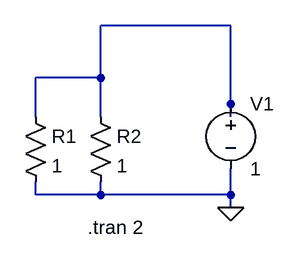
[diagram p0: schematic parallel.asc]
parallel.asc, the LTspice schematic file:
Version 4
SHEET 1 880 680
WIRE 176 128 16 128
WIRE 16 192 16 128
WIRE 16 192 -64 192
WIRE 176 224 176 128
WIRE -64 240 -64 192
WIRE 16 240 16 192
WIRE 176 240 176 224
WIRE -64 336 -64 320
WIRE 16 336 16 320
WIRE 16 336 -64 336
WIRE 176 336 176 304
WIRE 176 336 16 336
WIRE 176 352 176 336
FLAG 176 352 0
SYMBOL res 0 224 R0
SYMATTR InstName R2
SYMATTR Value 1
SYMBOL voltage 176 208 R0
WINDOW 123 0 0 Left 2
WINDOW 39 0 0 Left 2
SYMATTR InstName V1
SYMATTR Value 1
SYMBOL res -80 224 R0
SYMATTR InstName R1
SYMATTR Value 1
TEXT 0 376 Left 2 !.tran 2

The netlist it stands for:
* parallel.asc
R2 N001 0 1
V1 N001 0 1
R1 N001 0 1
.tran 2
.backanno
.end